# Altium schematic sheet Sheet1.SchDoc
size A4
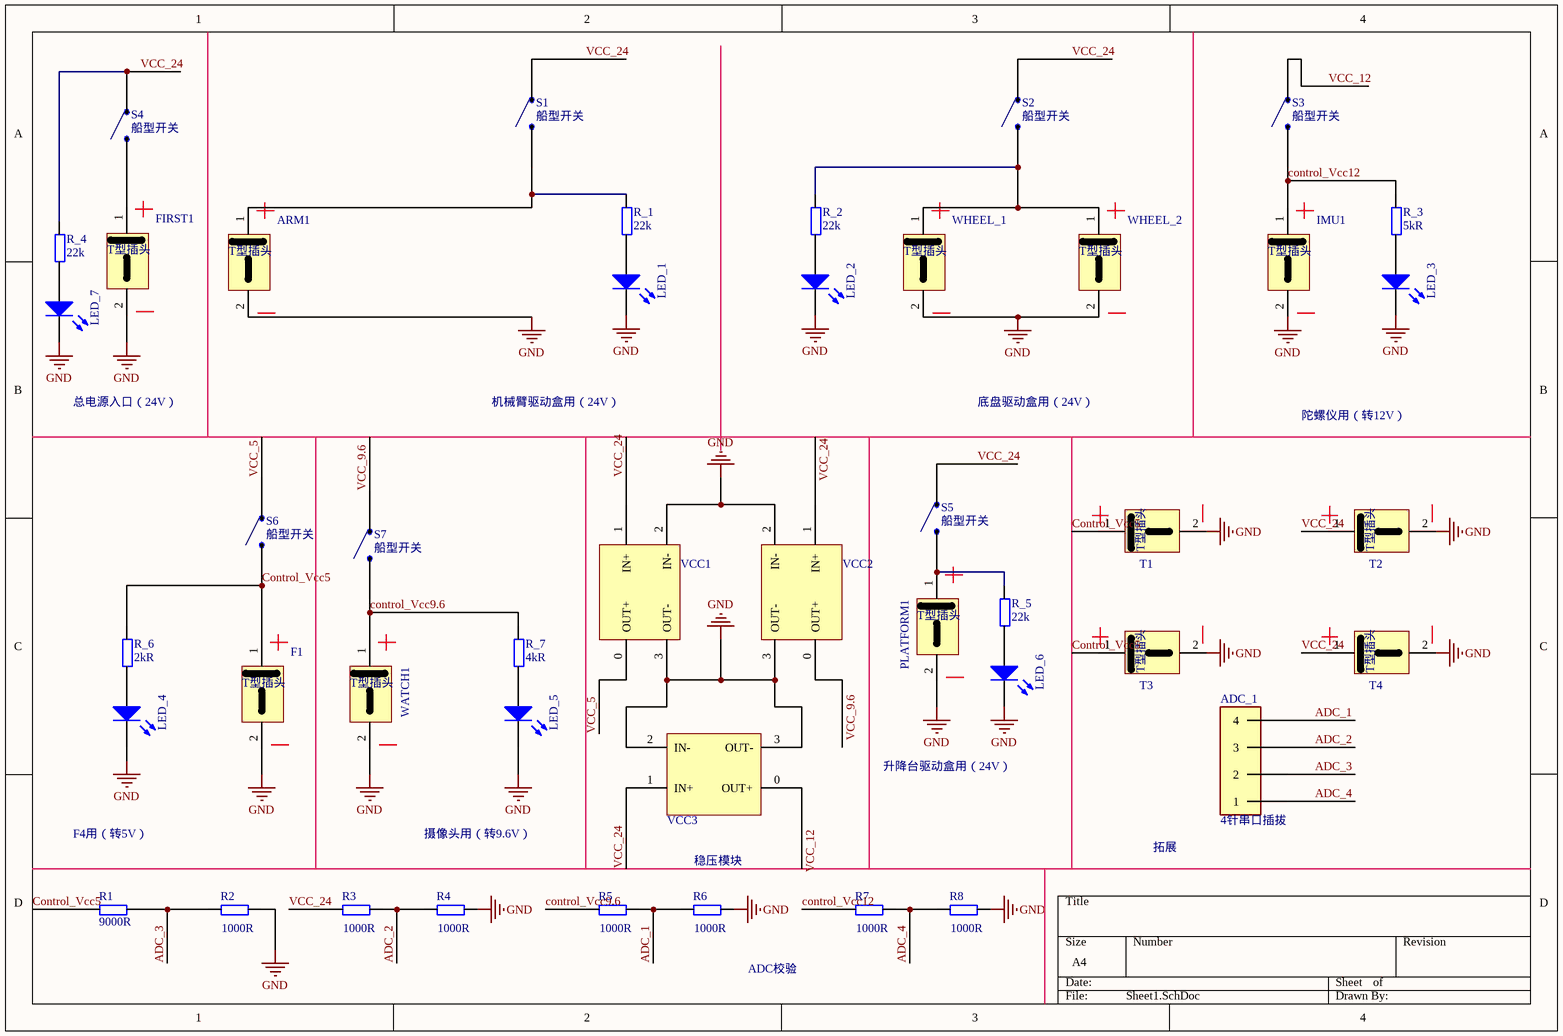
[diagram p0: Sheet1.SchDoc]

## Parts
ADC_1  4针串口插拔  [HDR_4针串口插拔]
ARM1  T型插头_WYN  [HDR_XT60]  (value not drawn)
F1  T型插头_WYN  [HDR_XT30]  (value not drawn)
FIRST1  T型插头_WYN  [HDR_XT60]  (value not drawn)
IMU1  T型插头_WYN  [HDR_XT30]  (value not drawn)
LED_1  LED  [ELE_SMDLED]  (value not drawn)
LED_2  LED  [ELE_SMDLED]  (value not drawn)
LED_3  LED  [ELE_SMDLED]  (value not drawn)
LED_4  LED  [ELE_SMDLED]  (value not drawn)
LED_5  LED  [ELE_SMDLED]  (value not drawn)
LED_6  LED  [ELE_SMDLED]  (value not drawn)
LED_7  LED  [ELE_SMDLED]  (value not drawn)
PLATFORM1  T型插头_WYN  [HDR_XT60]  (value not drawn)
R1  9000R  [ELE_0603_P]
R2  1000R  [ELE_0603_P]
R3  1000R  [ELE_0603_P]
R4  1000R  [ELE_0603_P]
R5  1000R  [ELE_0603_P]
R6  1000R  [ELE_0603_P]
R7  1000R  [ELE_0603_P]
R8  1000R  [ELE_0603_P]
R_1  22k  [ELE_0603_P]
R_2  22k  [ELE_0603_P]
R_3  5kR  [ELE_0603_P]
R_4  22k  [ELE_0603_P]
R_5  22k  [ELE_0603_P]
R_6  2kR  [ELE_0603_P]
R_7  4kR  [ELE_0603_P]
S1  船型开关  [ELE_船型开关]
S2  船型开关  [ELE_船型开关]
S3  船型开关  [ELE_船型开关1_D]
S4  船型开关  [ELE_船型开关]
S5  船型开关  [ELE_船型开关]
S6  船型开关  [ELE_船型开关1_D]
S7  船型开关  [ELE_船型开关1_D]
T1  T型插头_WYN  [HDR_XT30]  (value not drawn)
T2  T型插头_WYN  [HDR_XT60]  (value not drawn)
T3  T型插头_WYN  [HDR_XT30]  (value not drawn)
T4  T型插头_WYN  [HDR_XT60]  (value not drawn)
VCC1  TRANSFORM  [CHP_转压模块]  (value not drawn)
VCC2  TRANSFORM  [CHP_转压模块]  (value not drawn)
VCC3  TRANSFORM  [CHP_转压模块]  (value not drawn)
WATCH1  T型插头_WYN  [HDR_XT30]  (value not drawn)
WHEEL_1  T型插头_WYN  [HDR_XT60]  (value not drawn)
WHEEL_2  T型插头_WYN  [HDR_XT60]  (value not drawn)

## Nets
GND: ARM1.2 F1.2 FIRST1.2 IMU1.2 LED_1.2(K) LED_2.2(K) LED_3.2(K) LED_4.2(K) LED_5.2(K) LED_6.2(K) LED_7.2(K) PLATFORM1.2 R2.2 R4.2 R6.2 R8.2 T1.2 T2.2 T3.2 T4.2 VCC1.2(IN-) VCC1.3(OUT-) VCC2.2(IN-) VCC2.3(OUT-) VCC3.2(IN-) VCC3.3(OUT-) WATCH1.2 WHEEL_1.2 WHEEL_2.2
ADC_1: ADC_1.4 R5.2 R6.1
ADC_2: ADC_1.3 R3.2 R4.1
ADC_3: ADC_1.2 R1.2 R2.1
ADC_4: ADC_1.1 R7.2 R8.1
Control_Vcc5: F1.1 R1.1 R_6.2 S6.1 T1.1 T3.1
control_Vcc9.6: R5.1 R_7.2 S7.1 WATCH1.1
control_Vcc12: IMU1.1 R7.1 R_3.2 S3.1
VCC_5: S6.2 VCC1.0(OUT+)
VCC_9.6: S7.2 VCC2.0(OUT+)
VCC_12: S3.2 VCC3.0(OUT+)
VCC_24: R3.1 R_4.2 S1.2 S2.2 S4.2 S5.2 T2.1 T4.1 VCC1.1(IN+) VCC2.1(IN+) VCC3.1(IN+)
NetARM1_1: ARM1.1 R_1.2 S1.1
NetFIRST1_1: FIRST1.1 S4.1
NetLED_1_1: LED_1.1(A) R_1.1
NetLED_2_1: LED_2.1(A) R_2.1
NetLED_3_1: LED_3.1(A) R_3.1
NetLED_4_1: LED_4.1(A) R_6.1
NetLED_5_1: LED_5.1(A) R_7.1
NetLED_6_1: LED_6.1(A) R_5.1
NetLED_7_1: LED_7.1(A) R_4.1
NetPLATFORM1_1: PLATFORM1.1 R_5.2 S5.1
NetR_2_2: R_2.2 S2.1 WHEEL_1.1 WHEEL_2.1

## Notes on the sheet
- 总电源入口（24V）
- 机械臂驱动盒用（24V）
- 底盘驱动盒用（24V）
- 陀螺仪用（转12V）
- 升降台驱动盒用（24V）
- F4用（转5V）
- 摄像头用（转9.6V）
- 拓展
- (near R6) 稳压模块
- ADC校验
- (in symbol T型插头_WYN) T型插头

## Library data of the parts
LED_1-LED_7 = LED2: Typical RED, GREEN, YELLOW, AMBER GaAs LED; Published: 8-Jun-2000; LatestRevisionDate: 17-Jul-2002; LatestRevisionNote: Re-released for DXP Platform.; PackageDocument: Feb-2002; PackageReference: 3.2X1.6X1.1; Publisher: Altium Limited
R1-R8 R_1-R_7 = R